# EAGLE design HB-power_v1.3 (EAGLE 9.4.2)
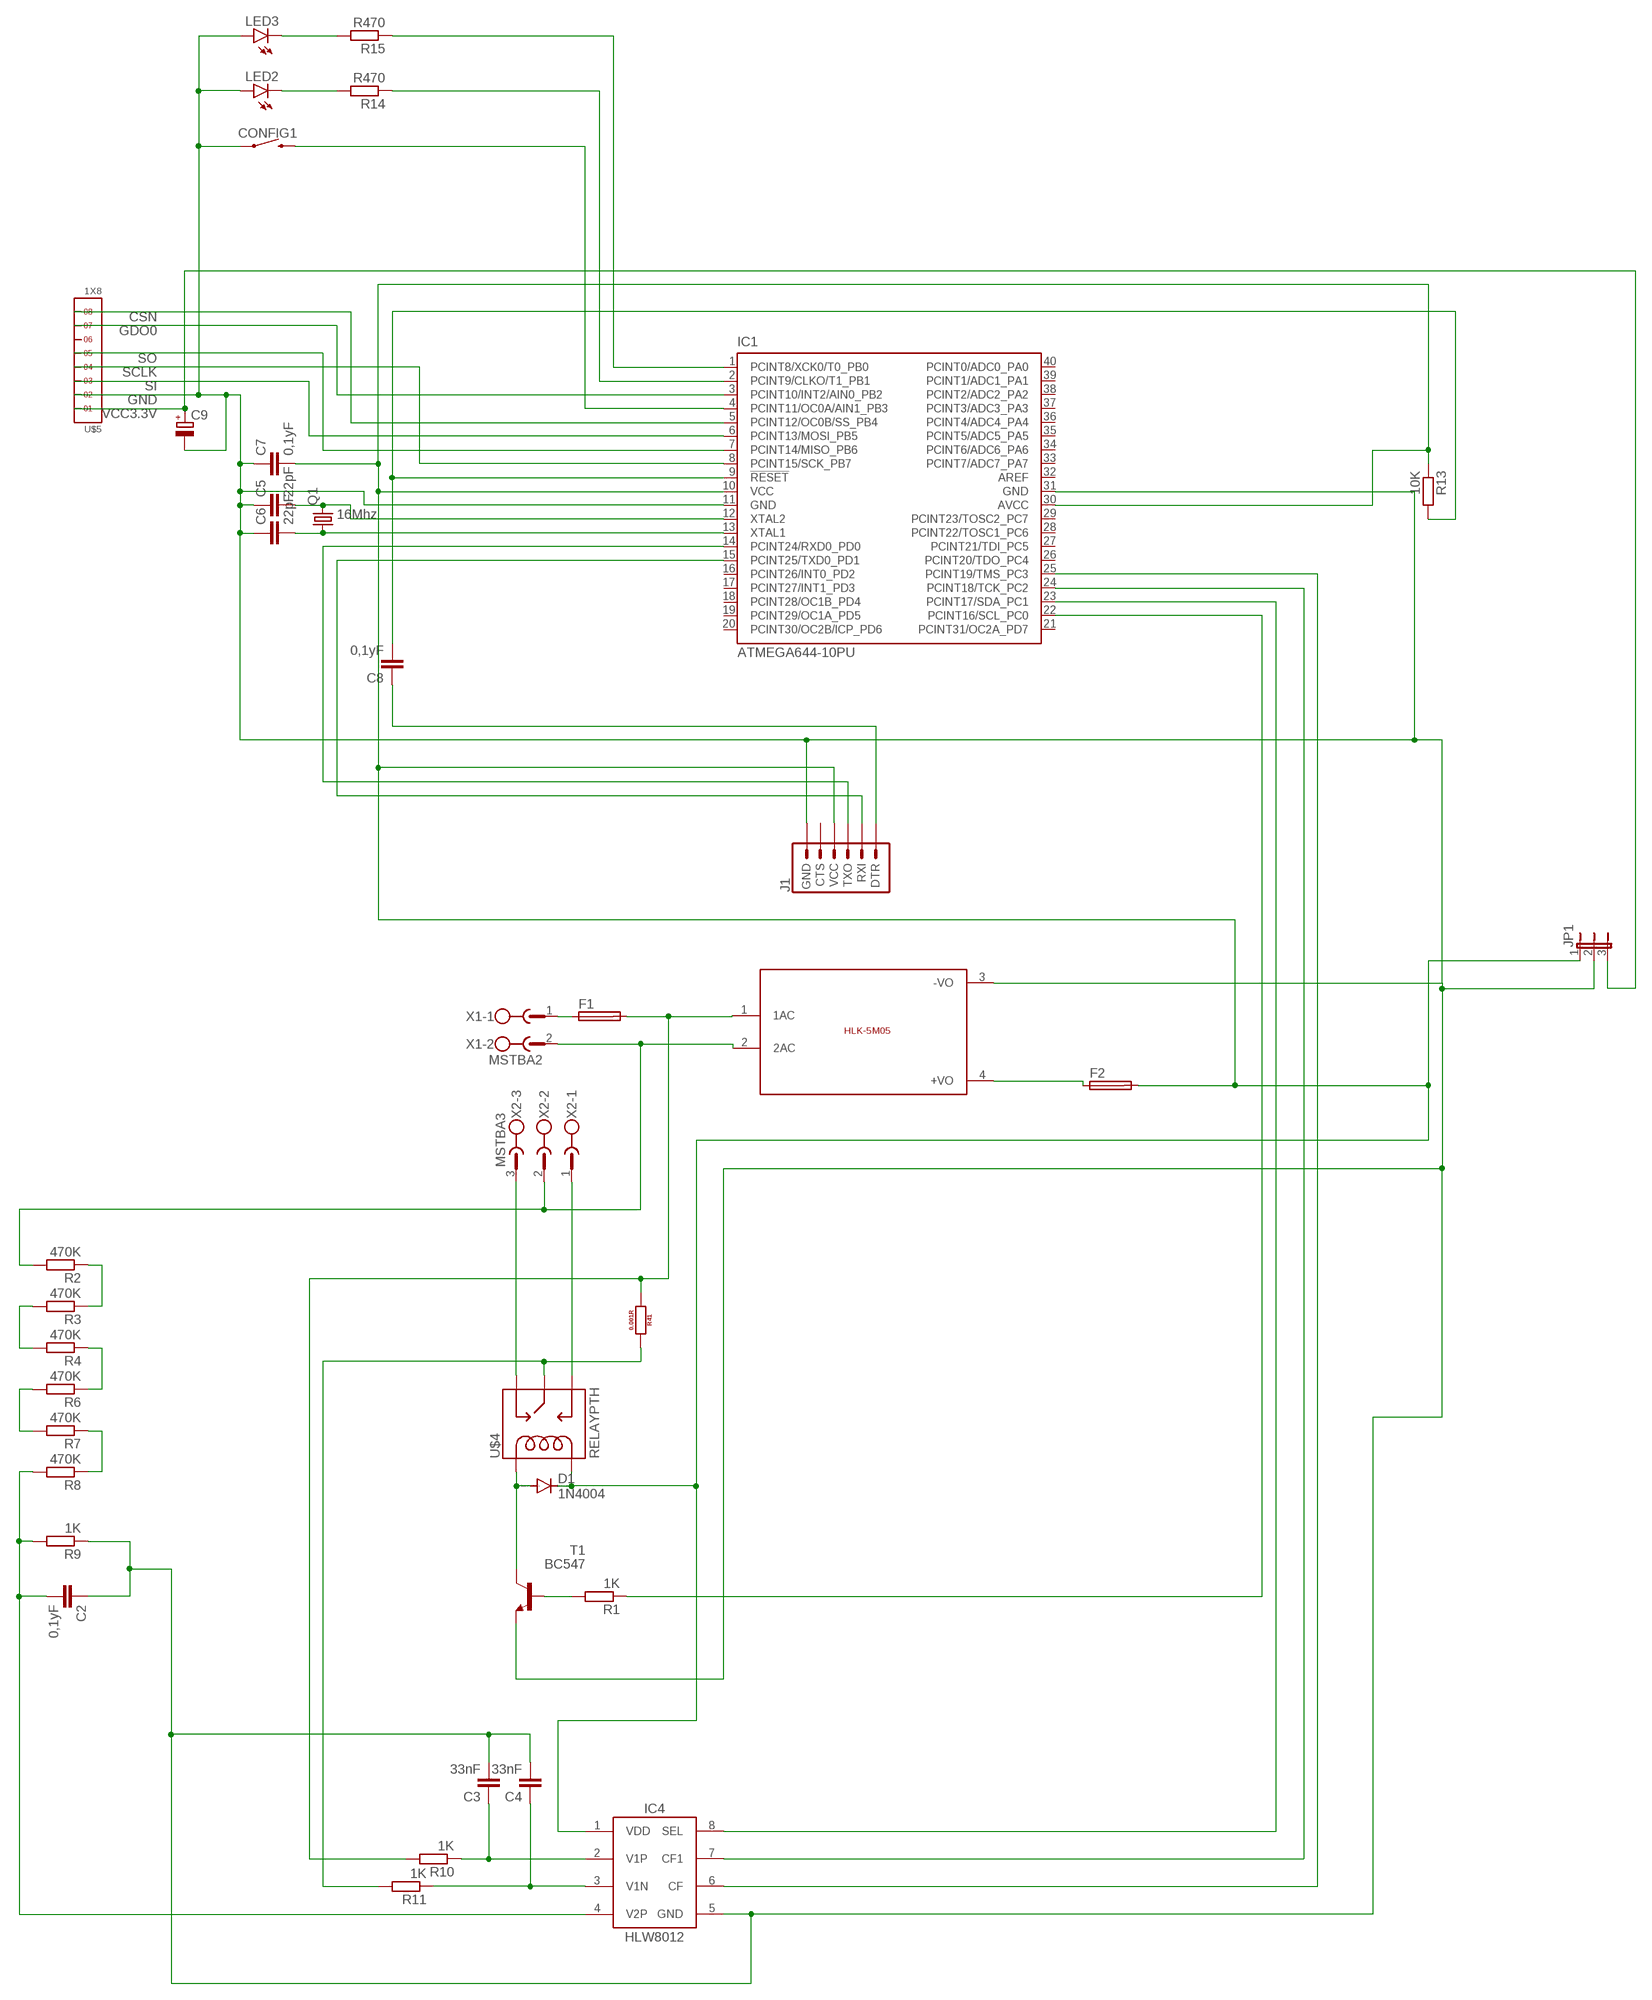
[diagram p0: schematic, sheet 1]

## Parts
C2  0,1yF  C-EU050-024X044  [C050-024X044]
C3  33nF  C-EU050-024X044  [C050-024X044]
C4  33nF  C-EU050-024X044  [C050-024X044]
C5  22pF  C-EU025-024X044  [C025-024X044]
C6  22pF  C-EU025-024X044  [C025-024X044]
C7  0,1yF  C-EU025-024X044  [C025-024X044]
C8  0,1yF  C-EU025-024X044  [C025-024X044]
C9  CPOL-EUE2.5-5  [E2,5-5]
CONFIG1  MOMENTARY-SWITCH-SPST-PTH-6.0MM-KIT  [TACTILE_SWITCH_PTH_6.0MM_KIT]
D1  1N4004  [DO41-10]
F1  SH22,5A  [SH22,5A]
F2  SH22,5A  [SH22,5A]
IC1  ATMEGA644-10PU  [DIL40]
IC4  HLW8012  [SOP8]
J1  6_PIN_SERIAL_TARGETLONGPADS  [1X06_LONGPADS]
JP1  JP2E  [JP2]
LED2  LED3MM  [LED3MM]
LED3  LED3MM  [LED3MM]
Q1  16Mhz  CRYSTALHC49U-V  [HC49U-V]
R1  1K  R-EU_0309/10  [0309/10]
R2  470K  R-EU_0309/10  [0309/10]
R3  470K  R-EU_0309/10  [0309/10]
R4  470K  R-EU_0309/10  [0309/10]
R6  470K  R-EU_0309/10  [0309/10]
R7  470K  R-EU_0309/10  [0309/10]
R8  470K  R-EU_0309/10  [0309/10]
R9  1K  R-EU_0309/10  [0309/10]
R10  1K  R-EU_0309/10  [0309/10]
R11  1K  R-EU_0309/10  [0309/10]
R13  10K  R-EU_0309/10  [0309/10]
R14  R470  R-EU_0309/10  [0309/10]
R15  R470  R-EU_0309/10  [0309/10]
R41  0.001R  RESISTOR2512  [2512]
T1  BC547  [TO92]
U$3  5VDC/5W  HLK-5M05  [HLK-5M05]
U$4  RELAYPTH  [SRD-05VDC-SL-C]
U$5  1X8  [1X8]
X1  MSTBA2  [MSTBA2]
X2  MSTBA3  [MSTBA3]

## Nets
CSN: IC1.5(PCINT12/OC0B/SS_PB4) U$5.8
GDO0: IC1.3(PCINT10/INT2/AIN0_PB2) U$5.7
GND: C2.1 C3.2 C4.2 C5.1 C6.1 C7.1 C9.- CONFIG1.1 IC1.11(GND) IC1.31(GND) IC4.5(GND) J1.6(GND) JP1.2 LED2.A LED3.A R9.1 T1.1(E) U$3.3(-VO) U$5.2
L: F1.1 X1.1
L1: F1.2 R10.2 R41.1 U$3.1(1AC)
L2: R11.2 R41.2 U$4.SWCOMMON
N: R2.2 U$3.2(2AC) X1.2 X2.2
N$1: D1.A T1.3(C) U$4.COIL1
N$2: R1.2 T1.2(B)
N$4: IC1.22(PCINT16/SCL_PC0) R1.1
N$6: IC1.23(PCINT17/SDA_PC1) IC4.8(SEL)
N$7: IC1.24(PCINT18/TCK_PC2) IC4.7(CF1)
N$8: IC1.25(PCINT19/TMS_PC3) IC4.6(CF)
N$9: C5.2 IC1.12(XTAL2) Q1.2
N$10: F2.1 U$3.4(+VO)
N$11: U$4.SWCLOSED(SWCLOSE) X2.3
N$12: U$4.SWOPEN X2.1
N$13: R2.1 R3.1
N$14: R4.1 R6.1
N$15: R7.1 R8.1
N$19: R3.2 R4.2
N$20: R6.2 R7.2
N$21: C2.2 IC4.4(V2P) R8.2 R9.2
N$22: C6.2 IC1.13(XTAL1) Q1.1
N$23: C3.1 IC4.2(V1P) R10.1
N$24: C8.1 J1.1(DTR)
N$25: C4.1 IC4.3(V1N) R11.1
N$26: C7.2 D1.C F2.2 IC1.10(VCC) IC1.30(AVCC) IC4.1(VDD) J1.4(VCC) JP1.1 R13.1 U$4.COIL0
N$27: C8.2 IC1.9(!RESET) R13.2
N$28: CONFIG1.3 IC1.4(PCINT11/OC0A/AIN1_PB3)
N$29: IC1.14(PCINT24/RXD0_PD0) J1.3(TXO)
N$30: IC1.15(PCINT25/TXD0_PD1) J1.2(RXI)
N$31: LED2.K(C) R14.2
N$32: LED3.K(C) R15.2
N$34: IC1.2(PCINT9/CLKO/T1_PB1) R14.1
N$35: IC1.1(PCINT8/XCK0/T0_PB0) R15.1
SCLK: IC1.8(PCINT15/SCK_PB7) U$5.4
SI: IC1.6(PCINT13/MOSI_PB5) U$5.3
SO: IC1.7(PCINT14/MISO_PB6) U$5.5
VCC3.3V: C9.+ JP1.3 U$5.1
Unconnected: IC1.16(PCINT26/INT0_PD2) IC1.17(PCINT27/INT1_PD3) IC1.18(PCINT28/OC1B_PD4) IC1.19(PCINT29/OC1A_PD5) IC1.20(PCINT30/OC2B/ICP_PD6) IC1.21(PCINT31/OC2A_PD7) IC1.26(PCINT20/TDO_PC4) IC1.27(PCINT21/TDI_PC5) IC1.28(PCINT22/TOSC1_PC6) IC1.29(PCINT23/TOSC2_PC7) IC1.32(AREF) IC1.33(PCINT7/ADC7_PA7) IC1.34(PCINT6/ADC6_PA6) IC1.35(PCINT5/ADC5_PA5) IC1.36(PCINT4/ADC4_PA4) IC1.37(PCINT3/ADC3_PA3) IC1.38(PCINT2/ADC2_PA2) IC1.39(PCINT1/ADC1_PA1) IC1.40(PCINT0/ADC0_PA0) J1.5(CTS) U$5.6

## Library data of the parts
C2-C8 = resistor:C-EU: CAPACITOR, European symbol
C9 = resistor:CPOL-EU: POLARIZED CAPACITOR, European symbol
CONFIG1 = SparkFun-Switches:MOMENTARY-SWITCH-SPST: Momentary Switch (Pushbutton) - SPST Normally-open (NO) SPST momentary switches (buttons, pushbuttons). Variants PTH-12MM - 12mm square, through-hole Momentary Pushbutton Switch - 12mm Square <https://www.sparkfun.com/products/9190> (COM-09190) PTH-6.0MM, PTH-6.0MM-KIT - 6.0mm square, through-hole Mini Pushbutton Switch <https://www.sparkfun.com/products/97> (COM-00097) KIT package intended for soldering kit's - only one side of pads' copper is exposed. PTH-RIGHT-ANGLE-KIT - Right-angle, through-hole Right Angle Tactile Button <https://www.sparkfun.com/products/10791> - Used on SparkFun BigTime Watch Kit <https://www.sparkfun.com/products/11734> SMD-12MM - 12mm square, surface-mount Tactile Button - SMD (12mm) <https://www.sparkfun.com/products/12993> (COM-12993) Used on SparkFun PicoBoard <https://www.sparkfun.com/products/11888> SMD-4.5MM - 4.5mm Square Trackball Switch Used on SparkFun Blackberry Trackballer Breakout <https://www.sparkfun.com/products/13169> SMD-4.6MMX2.8MM - 4.60mm x 2.80mm, surface mount Used on SparkFun SAMD21 Mini Breakout <https://www.sparkfun.com/products/13664> SMD-5.2MM, SMD-5.2-REDUNDANT - 5.2mm square, surface-mount Mini Pushbutton Switch - SMD <https://www.sparkfun.com/products/8720> (COM-08720) Used on Arduino Pro Mini <https://www.sparkfun.com/products/11114> REDUNDANT package connects both switch circuits together SMD-6.0X3.5MM - 6.0 x 3.5mm, surface mount Momentary Reset Switch SMD <https://www.sparkfun.com/products/8229> (COM-08229) SMD-6.2MM-TALL - 6.2mm square, surface mount Tactile Button - SMD (6mm) <https://www.sparkfun.com/products/12992> Used on SparkFun Digital Sandbox <https://www.sparkfun.com/products/12651> SMD-RIGHT-ANGLE - Right-angle, surface mount Used on SparkFun Block for Intel® Edison - Arduino <https://www.sparkfun.com/products/13036>; PROD_ID: SWCH-08441; SF_SKU: COM-00097
D1 = diode:1N4004: DIODE general purpose rectifier, 1 A
F1 F2 = fuse:SH22,5A: FUSE HOLDER grid 22,5mm, isolated cap OGN0031 8201, Schurter (Buerklin); MPN: 0031.7701.11; OC_FARNELL: unknown; OC_NEWARK: 04F1224
IC1 = atmel:ATMEGA644-*PU: 8-bit Microcontroller with 64K Bytes In-System Programmable Flash Auto generated by make-symbol-device-package-bsdl.ulp Rev. 34 Source: http://www.atmel.com/dyn/resources/prod_documents/doc2593.pdf; MPN: ATMEGA644V-10PU; OC_FARNELL: 1288342; OC_NEWARK: 23M5062
IC4 = xose:HLW8012
J1 = SparkFun-Connectors:6_PIN_SERIAL_TARGET: 6-pin header connection for use with the "FTDI BASIC" pinout - TARGET SIDE. Also known as "Arduino Serial Program Header". It is used to mate with our FTDI Basic serial programmers using the Arduino IDE. Note, this device has "TARGET" in the name. It is intended to be used on a design that contains a target micro-controller that you wish to program. The "sister" device, named "CABLE" is inteneded to be used on a design that usually lives on the end of your USB cable and prvides the converter chip (FTDI232 or FTDI231x) to commnicate serial RX/TX. You can populate with some of these: Break Away Headers - Straight <https://www.sparkfun.com/products/116> (PRT-00116) For reference (or to suit your programming needs) check out these designs: SparkFun FTDI Basic Breakout - 5V <https://www.sparkfun.com/products/9716> (DEV-09716) SparkFun FTDI Basic Breakout - 3.3V <https://www.sparkfun.com/products/9873> (DEV-09873) SparkFun FTDI SmartBasic <https://www.sparkfun.com/products/12935> (DEV-12935) SparkFun Beefy 3 - FTDI Basic Breakout <https://www.sparkfun.com/products/13746> (DEV-13746)
JP1 = jumper:JP2E: JUMPER
LED2 LED3 = led:LED: LED OSRAM: - CHIPLED LG R971, LG N971, LY N971, LG Q971, LY Q971, LO R971, LY R971 LH N974, LH R974 LS Q976, LO Q976, LY Q976 LO Q996 - Hyper CHIPLED LW Q18S LB Q993, LB Q99A, LB R99A - SideLED LS A670, LO A670, LY A670, LG A670, LP A670 LB A673, LV A673, LT A673, LW A673 LH A674 LY A675 LS A676, LA A676, LO A676, LY A676, LW A676 LS A679, LY A679, LG A679 - Hyper Micro SIDELED® LS Y876, LA Y876, LO Y876, LY Y876 LT Y87S - SmartLED LW L88C, LW L88S LB L89C, LB L89S, LG L890 LS L89K, LO L89K, LY L89K LS L896, LA L896, LO L896, LY L896 - TOPLED LS T670, LO T670, LY T670, LG T670, LP T670 LSG T670, LSP T670, LSY T670, LOP T670, LYG T670 LG T671, LOG T671, LSG T671 LB T673, LV T673, LT T673, LW T673 LH T674 LS T676, LA T676, LO T676, LY T676, LB T676, LH T676, LSB T676, LW T676 LB T67C, LV T67C, LT T67C, LS T67K, LO T67K, LY T67K, LW E67C LS E67B, LA E67B, LO E67B, LY E67B, LB E67C, LV E67C, LT E67C LW T67C LS T679, LY T679, LG T679 LS T770, LO T770, LY T770, LG T770, LP T770 LB T773, LV T773, LT T773, LW T773 LH T774 LS E675, LA E675, LY E675, LS T675 LS T776, LA T776, LO T776, LY T776, LB T776 LHGB T686 LT T68C, LB T68C - Hyper Mini TOPLED® LB M676 - Mini TOPLED Santana® LG M470 LS M47K, LO M47K, LY M47K Source: http://www.osram.convergy.de LUXEON: - LUMILED® LXK2-PW12-R00, LXK2-PW12-S00, LXK2-PW14-U00, LXK2-PW14-V00 LXK2-PM12-R00, LXK2-PM12-S00, LXK2-PM14-U00 LXK2-PE12-Q00, LXK2-PE12-R00, LXK2-PE12-S00, LXK2-PE14-T00, LXK2-PE14-U00 LXK2-PB12-K00, LXK2-PB12-L00, LXK2-PB12-M00, LXK2-PB14-N00, LXK2-PB14-P00, LXK2-PB14-Q00 LXK2-PR12-L00, LXK2-PR12-M00, LXK2-PR14-Q00, LXK2-PR14-R00 LXK2-PD12-Q00, LXK2-PD12-R00, LXK2-PD12-S00 LXK2-PH12-R00, LXK2-PH12-S00 LXK2-PL12-P00, LXK2-PL12-Q00, LXK2-PL12-R00 Source: www.luxeon.com KINGBRIGHT: KA-3528ASYC Source: www.kingbright.com
Q1 = crystal:CRYSTAL: CRYSTAL; OC_FARNELL: 1666969; OC_NEWARK: unknown
R1-R4 R6-R11 R13-R15 = resistor:R-EU_: RESISTOR, European symbol
R41 = xose:RESISTOR: Generic EU resistor symbol
T1 = transistor:BC547: NPN TRANSISTOR
U$3 = HLK-5M05:HLK-5M05: HLK-5M05 is an 5Volt/5W smps developed by HI-LINK; SIZE: 23x38(mm)
U$4 = SRD-05VDC-SL-C:RELAY: SPDT relay (COM-00101)
U$5 = headers(2mm):1X8
X1 = con-phoenix-508:MSTBA2: PHOENIX; MF: FARNELL; MPN: 1757242; OC_FARNELL: 3705171; OC_NEWARK: 71C4161
X2 = con-phoenix-508:MSTBA3: PHOENIX; MF: FARNELL; MPN: 1757255; OC_FARNELL: 3705183; OC_NEWARK: 71C4162

## Board
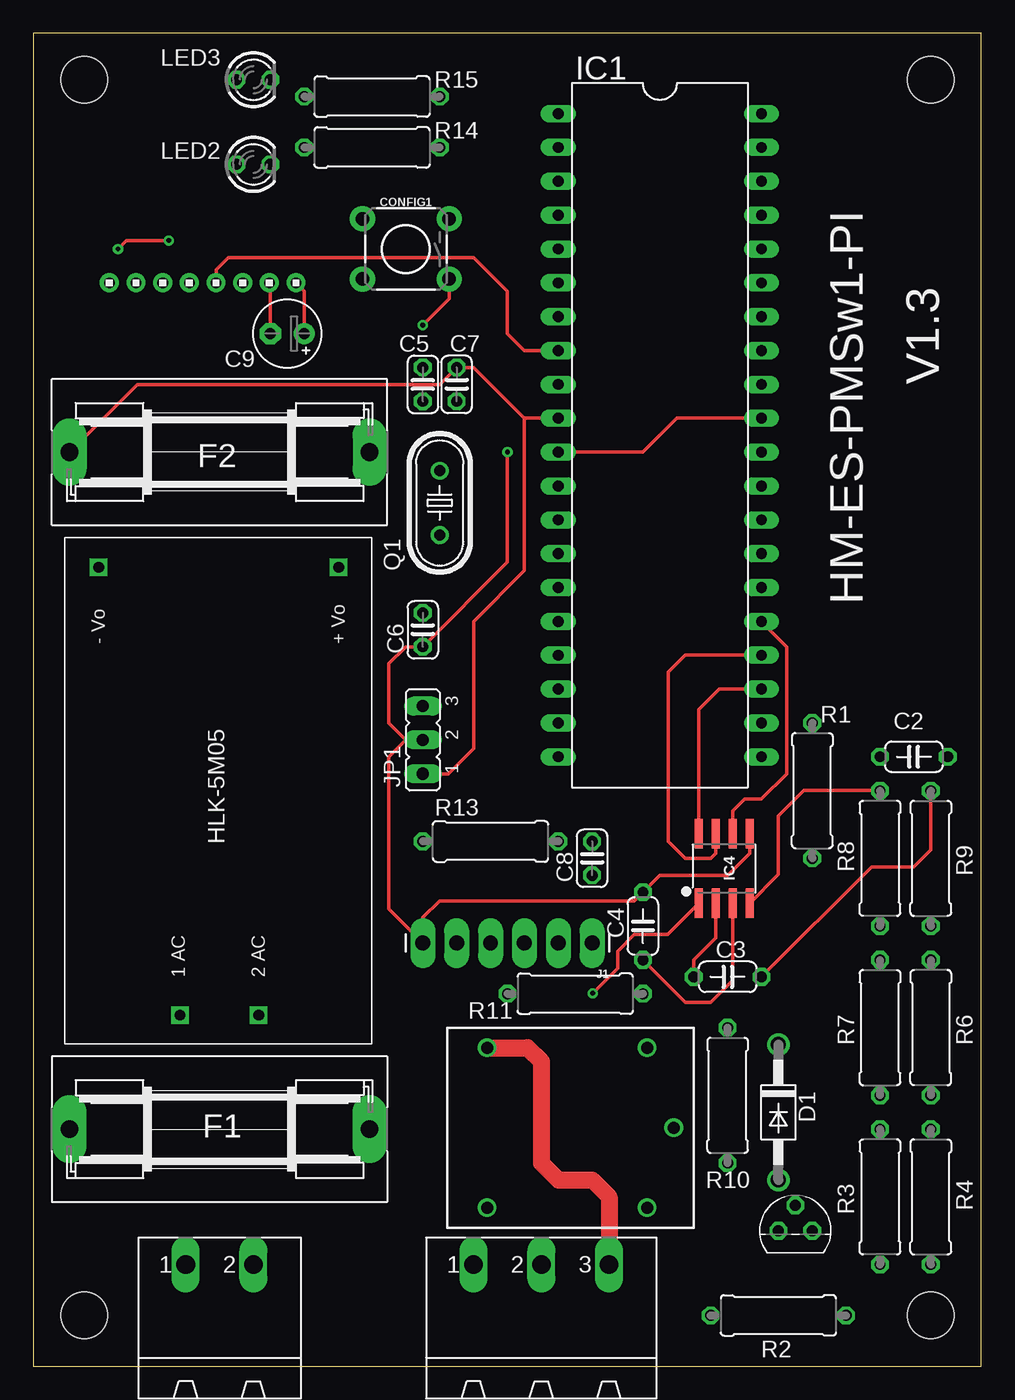
[diagram p1: board, top side]
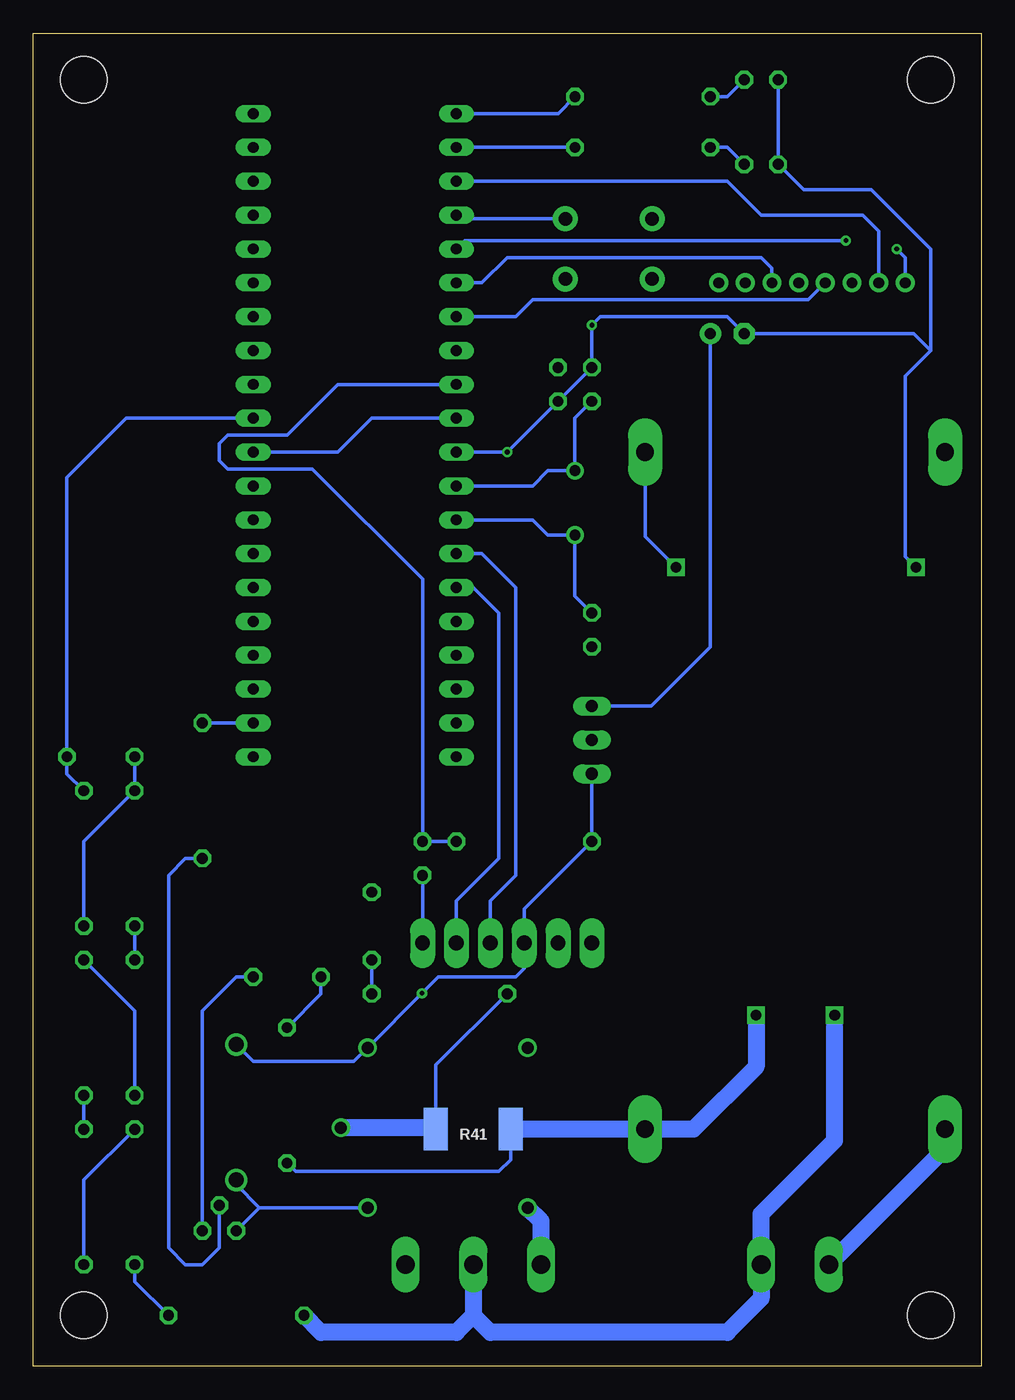
[diagram p2: board, bottom side, seen from below]

Size 71.1 x 100 mm. Coordinates in mm from the lower left corner, seen from the top.
Outline: 0,0 71.1,0 71.1,100 0,100 0,0
Copper layers (1*16): Top 0.035mm / dielectric 1.5mm / Bottom 0.035mm
Design rules "default": minimum track width 6mil, minimum drill 0.35mm, track to track 6mil, track to pad 6mil, pad to pad 6mil, via to via 6mil, smd to smd 6mil, copper to edge 40mil, drill to drill 6mil, minimum pad ring 10mil, minimum via ring 8mil, stop-mask expansion 4mil, vias tented up to drill 0mil, thermal gap 10mil
Holes 3.5 mm at 67.31,96.52 3.81,96.52 3.81,3.81 67.31,3.81

### Footprints (pad centres in the part's own frame; a part is rotated, then mirrored left to right if it is on the bottom)
C050-024X044 = drill 0.813 octagon: 1 -2.54,0; 2 2.54,0
C025-024X044 = drill 0.813 octagon: 1 -1.27,0; 2 1.27,0
E2,5-5 = drill 0.813 pad 1.6: + -1.27,0 | drill 0.813 pad 1.6 octagon: - 1.27,0
TACTILE_SWITCH_PTH_6.0MM_KIT = drill 1.016 pad 1.88: 1 -3.251,2.261; 2 3.251,2.261; 3 -3.251,-2.261; 4 3.251,-2.261
DO41-10 = drill 1.118: A 5.08,0; C -5.08,0
SH22,5A = drill 1.321 pad 2.54 long: 1 -11.252,0; 2 11.252,0
DIL40 = drill 0.813 long: 1 -24.13,-7.62; 2 -21.59,-7.62; 3 -19.05,-7.62; 4 -16.51,-7.62; 5 -13.97,-7.62; 6 -11.43,-7.62; 7 -8.89,-7.62; 8 -6.35,-7.62; 9 -3.81,-7.62; 10 -1.27,-7.62; 11 1.27,-7.62; 12 3.81,-7.62; 13 6.35,-7.62; 14 8.89,-7.62; 15 11.43,-7.62; 16 13.97,-7.62; 17 16.51,-7.62; 18 19.05,-7.62; 19 21.59,-7.62; 20 24.13,-7.62; 21 24.13,7.62; 22 21.59,7.62; 23 19.05,7.62; 24 16.51,7.62; 25 13.97,7.62; 26 11.43,7.62; 27 8.89,7.62; 28 6.35,7.62; 29 3.81,7.62; 30 1.27,7.62; 31 -1.27,7.62; 32 -3.81,7.62; 33 -6.35,7.62; 34 -8.89,7.62; 35 -11.43,7.62; 36 -13.97,7.62; 37 -16.51,7.62; 38 -19.05,7.62; 39 -21.59,7.62; 40 -24.13,7.62
SOP8 = smd 0.61 x 2.21: 1 0.381,-0.838; 2 1.651,-0.838; 3 2.921,-0.838; 4 4.191,-0.838; 5 4.191,4.394; 6 2.921,4.394; 7 1.651,4.394; 8 0.381,4.394
1X06_LONGPADS = drill 1.118 pad 1.88 long: 1 0,0; 2 2.54,0; 3 5.08,0; 4 7.62,0; 5 10.16,0; 6 12.7,0
JP2 = drill 0.914 long: 1 -2.54,0; 2 0,0; 3 2.54,0
LED3MM = drill 0.813 octagon: A -1.27,0; K 1.27,0
HC49U-V = drill 0.813: 1 -2.413,0; 2 2.413,0
0309/10 = drill 0.813 octagon: 1 -5.08,0; 2 5.08,0
2512 = smd 1.8 x 3.2: 1 -2.8,0; 2 2.8,0
TO92 = drill 0.813 octagon: 1 1.27,0; 2 0,1.905; 3 -1.27,0
HLK-5M05 = drill 0.8 square: 1 -16.85,-2.93; 2 -16.85,2.97; 3 16.75,9.07; 4 16.75,-8.93
SRD-05VDC-SL-C = drill 0.9: COIL0 -5.39,-6.12; COIL1 -5.39,5.88; SWCLOSED 6.61,-6.12; SWCOMMON -7.39,-0.12; SWOPEN 6.61,5.88
1X8 = drill 0.8 pad 1.422: 1 -7,0; 2 -5,0; 3 -3,0; 4 -1,0; 5 1,0; 6 3,0; 7 5,0; 8 7,0
MSTBA2 = drill 1.397 long: 1 -2.54,5.08; 2 2.54,5.08
MSTBA3 = drill 1.397 long: 1 -5.08,5.08; 2 0,5.08; 3 5.08,5.08

### Placement (x,y rotation side)
C2  66.04,45.72 180 top
C3  52.07,29.21 0 top
C4  45.72,33.02 90 top
C5  29.21,73.66 270 top
C6  29.21,55.24 90 top
C7  31.75,73.66 90 top
C8  41.91,38.1 90 top
C9  19.05,77.47 180 top
CONFIG1  27.94,83.82 180 top
D1  55.88,19.05 270 top
F1  13.97,17.78 0 top
F2  13.97,68.58 180 top
IC1  46.99,69.85 270 top
IC4  49.53,35.56 0 top
J1  41.91,31.75 180 top
JP1  29.21,46.99 90 top
LED2  16.51,90.17 0 top
LED3  16.51,96.52 0 top
Q1  30.48,64.77 90 top
R1  58.42,43.18 270 top
R2  55.88,3.81 180 top
R3  63.5,12.7 90 top
R4  67.31,12.7 270 top
R6  67.31,25.4 90 top
R7  63.5,25.4 270 top
R8  63.5,38.1 90 top
R9  67.31,38.1 270 top
R10  52.07,20.32 270 top
R11  40.64,27.94 180 top
R13  34.29,39.37 0 top
R14  25.4,91.44 180 top
R15  25.4,95.25 180 top
R41  38.1,17.78 180 bottom
T1  57.15,10.16 0 top
U$3  13.97,43.18 90 top
U$4  40.64,17.78 180 top
U$5  12.7,81.28 180 top
X1  13.97,2.54 0 top
X2  38.1,2.54 0 top

### Tracks (layer width: path | path; a pad name or v marks a point on that pad's centre or on a via)
CSN  (via drill 0.35)
  Top 0.254: v10.16,84.45 6.99,84.45 v6.35,83.82
  Bottom 0.254: IC1.5 38.73,84.45 v10.16,84.45 | v6.35,83.82 5.7,83.17 U$5.8
GDO0
  Bottom 0.254: IC1.3 19.05,88.9 16.51,86.36 8.89,86.36 7.7,85.17 U$5.7
GND  (via drill 0.35)
  Top 0.152: J1.6 29.21,33.66
  Top 0.254: IC1.31 48.26,71.12 45.72,68.58 IC1.11 | CONFIG1.1 31.19,80.09 v29.21,78.11 | v35.56,68.58 35.56,60.33 C6.1 27.94,53.98 26.67,52.7 26.67,48.26 27.94,46.99 | 29.21,33.66 30.48,34.92 45.09,34.92 C4.2 46.99,36.83 52.07,36.83 53.72,38.48 IC4.5 | JP1.2 27.94,46.99 | 27.94,46.99 26.67,45.72 26.67,34.29 J1.6 | C3.2 62.87,37.47 66.04,37.47 67.31,38.73 R9.1 | U$5.2 17.78,81.2 C9.-
  Bottom 0.254: R9.1 68.58,44.45 C2.1 68.58,66.67 64.14,71.12 IC1.31 | T1.1 58.42,26.67 55.88,29.21 C3.2 | LED3.A LED2.A 13.34,88.27 8.26,88.27 3.81,83.82 3.81,76.2 | 3.81,76.2 5.71,74.3 5.71,60.74 U$3.3 | 3.81,76.2 5.08,77.47 C9.- 19.05,78.74 28.57,78.74 v29.21,78.11 C5.1 C7.1 v35.56,68.58 IC1.11
L
  Bottom 1.27: X1.1 2.72,16.33 F1.1
L1
  Bottom 0.254: R41.1 35.3,15.5 36.2,14.61 51.44,14.61 R10.2
  Bottom 1.27: U$3.1 16.9,22.47 21.59,17.78 F1.2 R41.1
L2
  Bottom 0.254: R41.2 40.9,22.6 R11.2
  Bottom 1.27: R41.2 41.02,17.9 U$4.SWCOMMON
N
  Bottom 1.27: U$3.2 11,16.94 16.51,11.43 X1.2 16.51,5.08 19.05,2.54 36.83,2.54 38.1,3.81 | X2.2 38.1,3.81 | 38.1,3.81 39.37,2.54 49.53,2.54 R2.2
N$1
  Bottom 0.254: U$4.COIL1 54.14,11.9 | 54.14,11.9 T1.3 | D1.A 55.88,13.64 54.14,11.9
N$2
  Bottom 0.254: T1.2 57.15,8.89 58.42,7.62 59.69,7.62 60.96,8.89 60.96,36.83 59.69,38.1 R1.2
N$4
  Bottom 0.254: IC1.22 R1.1
N$6
  Top 0.254: IC1.23 51.44,50.8 49.91,49.28 IC4.8
N$7
  Top 0.254: IC1.24 48.9,53.34 47.62,52.07 47.62,39.37 48.9,38.1 50.8,38.1 51.18,38.48 IC4.7
N$8
  Top 0.254: IC1.25 56.52,53.98 56.52,44.45 54.61,42.55 53.34,42.55 52.45,41.66 IC4.6
N$9
  Bottom 0.254: IC1.12 33.66,66.04 32.51,67.18 Q1.2 30.48,71.12 C5.2
N$10
  Bottom 0.254: U$3.4 25.22,62.25 F2.1
N$11
  Top 1.27: U$4.SWCLOSED 37.06,23.9 38.1,22.86 38.1,15.24 39.37,13.97 41.91,13.97 43.18,12.7 X2.3
N$12
  Bottom 1.27: X2.1 33.02,10.89 U$4.SWOPEN
N$13
  Bottom 0.254: R2.1 63.5,6.35 R3.1
N$14
  Bottom 0.254: R4.1 R6.1
N$15
  Bottom 0.254: R7.1 R8.1
N$19
  Bottom 0.254: R3.2 67.31,13.97 R4.2
N$20
  Bottom 0.254: R7.2 63.5,26.67 R6.2
N$21
  Top 0.254: IC4.4 55.88,36.88 55.88,41.27 57.78,43.18 R8.2
  Bottom 0.254: R9.2 67.31,39.37 R8.2 C2.2
N$22
  Bottom 0.254: IC1.13 33.66,63.5 32.51,62.36 Q1.1 30.48,57.78 C6.2
N$23
  Top 0.254: C3.1 49.53,30.48 51.18,32.13 IC4.2
  Bottom 0.254: R10.1 49.53,27.94 C3.1
N$24
  Bottom 0.254: C8.1 J1.1
N$25
  Top 0.254: C4.1 48.9,27.3 50.8,27.3 52.45,28.96 IC4.3
  Bottom 0.254: C4.1 R11.1
N$26  (via drill 0.35)
  Top 0.254: F2.2 7.8,73.66 30.48,73.66 C7.2 33.02,74.93 36.83,71.12 | 36.83,71.12 IC1.10 | 36.83,71.12 36.83,59.69 33.02,55.88 33.02,46.35 31.11,44.45 JP1.1 | IC4.1 47.57,32.38 45.09,32.38 43.81,31.11 43.81,29.84 v41.95,27.98 41.91,27.94
  Bottom 0.254: D1.C 54.61,22.86 47.07,22.86 U$4.COIL0 v41.95,27.98 40.72,29.21 34.92,29.21 34.29,29.84 J1.4 34.29,34.29 R13.1 JP1.1 | IC1.10 45.72,71.12 48.26,68.58 IC1.30
N$27
  Bottom 0.254: IC1.9 48.26,73.66 52.07,69.85 56.52,69.85 57.15,69.22 57.15,67.94 56.52,67.31 50.16,67.31 41.91,59.05 C8.2 R13.2
N$28
  Bottom 0.254: IC1.4 39.09,86.08 CONFIG1.3
N$29
  Bottom 0.254: IC1.14 37.47,60.96 34.92,58.42 34.92,36.83 36.83,34.92 J1.3
N$30
  Bottom 0.254: IC1.15 38.1,58.42 36.2,56.52 36.2,38.1 39.37,34.92 J1.2
N$31
  Bottom 0.254: R14.2 19.05,91.44 LED2.K
N$32
  Bottom 0.254: R15.2 19.05,95.25 LED3.K
N$34
  Bottom 0.254: IC1.2 R14.1
N$35
  Bottom 0.254: IC1.1 31.75,93.98 R15.1
SCLK
  Top 0.254: U$5.4 13.7,82.28 14.61,83.19 33.02,83.19 35.56,80.64 35.56,77.47 36.83,76.2 IC1.8
SI
  Bottom 0.254: U$5.3 15.7,82.38 16.51,83.19 35.56,83.19 37.47,81.28 IC1.6
SO
  Bottom 0.254: U$5.5 12.97,80.01 33.66,80.01 34.92,78.74 IC1.7
VCC3.3V
  Top 0.254: U$5.1 20.32,80.66 C9.+
  Bottom 0.254: C9.+ 20.32,53.98 24.77,49.53 JP1.3

### Text on the board
tNames: V1.3 | HM-ES-PMSw1-PI